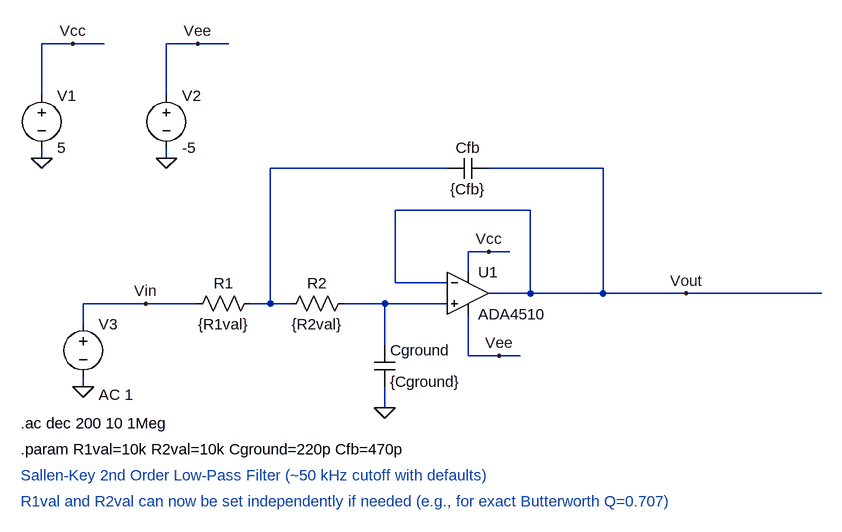
[diagram p0: schematic SallenKey_LPF.asc]
SallenKey_LPF.asc, the LTspice schematic file:
Version 4
SHEET 1 880 680
WIRE -368 -208 -416 -208
WIRE -320 -208 -368 -208
WIRE -176 -208 -224 -208
WIRE -128 -208 -176 -208
WIRE -416 -128 -416 -208
WIRE -224 -128 -224 -208
WIRE -416 -32 -416 -48
WIRE -224 -32 -224 -48
WIRE 208 -16 -64 -16
WIRE 448 -16 272 -16
WIRE 336 48 128 48
WIRE 272 112 240 112
WIRE 304 112 272 112
WIRE 240 144 240 112
WIRE 128 160 128 48
WIRE 208 160 128 160
WIRE 336 176 336 48
WIRE 336 176 272 176
WIRE 448 176 448 -16
WIRE 448 176 336 176
WIRE 576 176 448 176
WIRE 784 176 576 176
WIRE -256 192 -352 192
WIRE -176 192 -256 192
WIRE -64 192 -64 -16
WIRE -64 192 -96 192
WIRE -32 192 -64 192
WIRE 112 192 48 192
WIRE 208 192 112 192
WIRE -352 224 -352 192
WIRE 112 256 112 192
WIRE 240 272 240 208
WIRE 288 272 240 272
WIRE 320 272 288 272
WIRE -352 320 -352 304
WIRE 112 352 112 320
FLAG -416 -32 0
FLAG -224 -32 0
FLAG -368 -208 Vcc
FLAG -176 -208 Vee
FLAG -352 320 0
FLAG 112 352 0
FLAG 288 272 Vee
FLAG 272 112 Vcc
FLAG -256 192 Vin
FLAG 576 176 Vout
SYMBOL OpAmps\\ADA4510 240 112 R0
SYMATTR InstName U1
SYMBOL voltage -416 -144 R0
WINDOW 123 0 0 Left 0
WINDOW 39 0 0 Left 0
SYMATTR InstName V1
SYMATTR Value 5
SYMBOL voltage -224 -144 R0
WINDOW 123 0 0 Left 0
WINDOW 39 0 0 Left 0
SYMATTR InstName V2
SYMATTR Value -5
SYMBOL voltage -352 208 R0
WINDOW 123 24 124 Left 2
WINDOW 39 0 0 Left 0
SYMATTR InstName V3
SYMATTR Value ""
SYMATTR Value2 AC 1
SYMBOL cap 208 0 R270
WINDOW 0 32 32 VTop 2
WINDOW 3 0 32 VBottom 2
SYMATTR InstName Cfb
SYMATTR Value {Cfb}
SYMBOL res -80 176 R90
WINDOW 0 0 56 VBottom 2
WINDOW 3 32 56 VTop 2
SYMATTR InstName R1
SYMATTR Value {R1val}
SYMBOL res 64 176 R90
WINDOW 0 0 56 VBottom 2
WINDOW 3 32 56 VTop 2
SYMATTR InstName R2
SYMATTR Value {R2val}
SYMBOL cap 96 256 R0
SYMATTR InstName Cground
SYMATTR Value {Cground}
TEXT -448 376 Left 2 !.ac dec 200 10 1Meg
TEXT -448 416 Left 2 !.param R1val=10k R2val=10k Cground=220p Cfb=470p
TEXT -448 456 Left 2 ;Sallen-Key 2nd Order Low-Pass Filter (~50 kHz cutoff with defaults)
TEXT -448 496 Left 2 ;R1val and R2val can now be set independently if needed (e.g., for exact Butterworth Q=0.707)

The netlist it stands for:
* SallenKey_LPF.asc
XU1 N002 Vout Vcc Vee Vout ADA4510  ; pins In+ In- V+ V- OUT
V1 Vcc 0 5
V2 Vee 0 -5
V3 Vin 0 AC 1
Cfb N001 Vout {Cfb}
R1 N001 Vin {R1val}
R2 N002 N001 {R2val}
Cground N002 0 {Cground}
.ac dec 200 10 1Meg
.param R1val=10k R2val=10k Cground=220p Cfb=470p
* Sallen-Key 2nd Order Low-Pass Filter (~50 kHz cutoff with defaults)
* R1val and R2val can now be set independently if needed (e.g., for exact Butterworth Q=0.707)
.backanno
.end